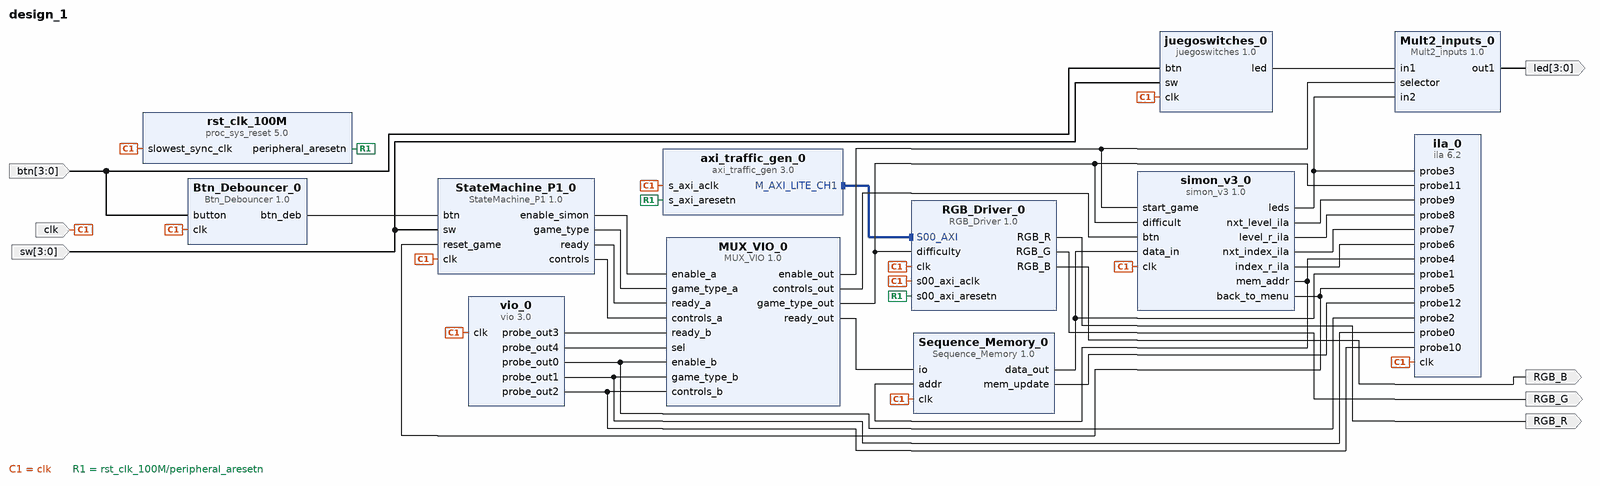
[diagram p0: block diagram of the top level]
# Vivado block design design_1, xc7z010clg400-1, Vivado 2020.1
create_bd_design design_1

create_bd_port -dir I -type clk clk
create_bd_port -dir I -from 3 -to 0 btn
create_bd_port -dir I -from 3 -to 0 sw
create_bd_port -dir O RGB_R
create_bd_port -dir O RGB_G
create_bd_port -dir O RGB_B
create_bd_port -dir O -from 3 -to 0 led

create_bd_cell -type ip -vlnv xilinx.com:user:Btn_Debouncer:1.0 Btn_Debouncer_0
create_bd_cell -type ip -vlnv xilinx.com:ip:vio:3.0 vio_0
set_property -dict [list \
  CONFIG.C_NUM_PROBE_IN 0 \
  CONFIG.C_NUM_PROBE_OUT 5 \
  CONFIG.C_PROBE_OUT0_WIDTH 1 \
  CONFIG.C_PROBE_OUT1_WIDTH 2 \
  CONFIG.C_PROBE_OUT2_WIDTH 4 \
] [get_bd_cells vio_0]
create_bd_cell -type ip -vlnv xilinx.com:ip:ila:6.2 ila_0
set_property -dict [list \
  CONFIG.C_ENABLE_ILA_AXI_MON false \
  CONFIG.C_MONITOR_TYPE Native \
  CONFIG.C_NUM_OF_PROBES 13 \
  CONFIG.C_PROBE0_WIDTH 2 \
  CONFIG.C_PROBE10_WIDTH 4 \
  CONFIG.C_PROBE1_WIDTH 4 \
  CONFIG.C_PROBE3_WIDTH 4 \
  CONFIG.C_PROBE4_WIDTH 5 \
  CONFIG.C_PROBE5_WIDTH 1 \
  CONFIG.C_PROBE6_WIDTH 5 \
  CONFIG.C_PROBE7_WIDTH 5 \
  CONFIG.C_PROBE8_WIDTH 6 \
  CONFIG.C_PROBE9_WIDTH 6 \
] [get_bd_cells ila_0]
create_bd_cell -type ip -vlnv xilinx.com:user:MUX_VIO:1.0 MUX_VIO_0
create_bd_cell -type ip -vlnv xilinx.com:ip:axi_traffic_gen:3.0 axi_traffic_gen_0
set_property -dict [list \
  CONFIG.C_ATG_MODE AXI4-Lite \
  CONFIG.C_ATG_SYSINIT_MODES System_Test \
  CONFIG.C_ATG_SYSTEM_CMD_MAX_RETRY 2147483647 \
  CONFIG.C_ATG_SYSTEM_INIT_ADDR_MIF ../../../../../../../COE_files/address.coe \
  CONFIG.C_ATG_SYSTEM_INIT_CTRL_MIF ../../../../../../../COE_files/control.coe \
  CONFIG.C_ATG_SYSTEM_INIT_DATA_MIF ../../../../../../../COE_files/data.coe \
  CONFIG.C_ATG_SYSTEM_INIT_MASK_MIF ../../../../../../../COE_files/mask.coe \
] [get_bd_cells axi_traffic_gen_0]
create_bd_cell -type ip -vlnv xilinx.com:user:StateMachine_P1:1.0 StateMachine_P1_0
create_bd_cell -type ip -vlnv xilinx.com:user:Mult2_inputs:1.0 Mult2_inputs_0
create_bd_cell -type ip -vlnv xilinx.com:ip:proc_sys_reset:5.0 rst_clk_100M
create_bd_cell -type ip -vlnv xilinx.com:user:simon_v3:1.0 simon_v3_0
create_bd_cell -type ip -vlnv xilinx.com:user:Sequence_Memory:1.0 Sequence_Memory_0
create_bd_cell -type ip -vlnv xilinx.com:user:RGB_Driver:1.0 RGB_Driver_0
create_bd_cell -type ip -vlnv xilinx.com:user:juegoswitches:1.0 juegoswitches_0

# ---- connections ----

connect_bd_intf_net [get_bd_intf_pins axi_traffic_gen_0/M_AXI_LITE_CH1] [get_bd_intf_pins RGB_Driver_0/S00_AXI]
connect_bd_net -net clk_0_1 [get_bd_ports clk] \
  [get_bd_pins Btn_Debouncer_0/clk] [get_bd_pins vio_0/clk] [get_bd_pins ila_0/clk] \
  [get_bd_pins axi_traffic_gen_0/s_axi_aclk] [get_bd_pins StateMachine_P1_0/clk] [get_bd_pins rst_clk_100M/slowest_sync_clk] \
  [get_bd_pins simon_v3_0/clk] [get_bd_pins Sequence_Memory_0/clk] [get_bd_pins RGB_Driver_0/clk] \
  [get_bd_pins RGB_Driver_0/s00_axi_aclk] [get_bd_pins juegoswitches_0/clk]
connect_bd_net [get_bd_pins Btn_Debouncer_0/btn_deb] [get_bd_pins StateMachine_P1_0/btn]
connect_bd_net [get_bd_ports btn] [get_bd_pins Btn_Debouncer_0/button] [get_bd_pins juegoswitches_0/btn]
connect_bd_net -net sw_0_1 [get_bd_ports sw] [get_bd_pins StateMachine_P1_0/sw] [get_bd_pins juegoswitches_0/sw]
connect_bd_net [get_bd_pins StateMachine_P1_0/enable_simon] [get_bd_pins MUX_VIO_0/enable_a]
connect_bd_net [get_bd_pins StateMachine_P1_0/game_type] [get_bd_pins MUX_VIO_0/game_type_a]
connect_bd_net [get_bd_pins vio_0/probe_out0] [get_bd_pins ila_0/probe2] [get_bd_pins MUX_VIO_0/enable_b]
connect_bd_net [get_bd_pins vio_0/probe_out1] [get_bd_pins ila_0/probe0] [get_bd_pins MUX_VIO_0/game_type_b]
connect_bd_net [get_bd_pins vio_0/probe_out2] [get_bd_pins ila_0/probe10] [get_bd_pins MUX_VIO_0/controls_b]
connect_bd_net [get_bd_pins MUX_VIO_0/enable_out] [get_bd_pins Mult2_inputs_0/selector] [get_bd_pins simon_v3_0/start_game]
connect_bd_net [get_bd_pins MUX_VIO_0/game_type_out] \
  [get_bd_pins ila_0/probe11] [get_bd_pins simon_v3_0/difficult] [get_bd_pins RGB_Driver_0/difficulty]
connect_bd_net [get_bd_pins Sequence_Memory_0/data_out] [get_bd_pins ila_0/probe1] [get_bd_pins simon_v3_0/data_in]
connect_bd_net [get_bd_pins simon_v3_0/nxt_level_ila] [get_bd_pins ila_0/probe9]
connect_bd_net [get_bd_pins simon_v3_0/level_r_ila] [get_bd_pins ila_0/probe8]
connect_bd_net [get_bd_pins simon_v3_0/nxt_index_ila] [get_bd_pins ila_0/probe7]
connect_bd_net [get_bd_pins simon_v3_0/index_r_ila] [get_bd_pins ila_0/probe6]
connect_bd_net [get_bd_pins simon_v3_0/back_to_menu] [get_bd_pins ila_0/probe5] [get_bd_pins StateMachine_P1_0/reset_game]
connect_bd_net [get_bd_pins simon_v3_0/mem_addr] [get_bd_pins ila_0/probe4] [get_bd_pins Sequence_Memory_0/addr]
connect_bd_net [get_bd_pins simon_v3_0/leds] [get_bd_pins ila_0/probe3] [get_bd_pins Mult2_inputs_0/in2]
connect_bd_net [get_bd_pins StateMachine_P1_0/ready] [get_bd_pins MUX_VIO_0/ready_a]
connect_bd_net [get_bd_pins vio_0/probe_out3] [get_bd_pins MUX_VIO_0/ready_b]
connect_bd_net [get_bd_pins vio_0/probe_out4] [get_bd_pins MUX_VIO_0/sel]
connect_bd_net [get_bd_pins MUX_VIO_0/controls_out] [get_bd_pins simon_v3_0/btn]
connect_bd_net -net StateMachine_P1_0_buttons [get_bd_pins StateMachine_P1_0/controls] [get_bd_pins MUX_VIO_0/controls_a]
connect_bd_net [get_bd_pins MUX_VIO_0/ready_out] [get_bd_pins Sequence_Memory_0/io]
connect_bd_net [get_bd_pins juegoswitches_0/led] [get_bd_pins Mult2_inputs_0/in1]
connect_bd_net [get_bd_pins Mult2_inputs_0/out1] [get_bd_ports led]
connect_bd_net [get_bd_pins rst_clk_100M/peripheral_aresetn] [get_bd_pins axi_traffic_gen_0/s_axi_aresetn] [get_bd_pins RGB_Driver_0/s00_axi_aresetn]
connect_bd_net [get_bd_pins Sequence_Memory_0/mem_update] [get_bd_pins ila_0/probe12]
connect_bd_net [get_bd_pins RGB_Driver_0/RGB_R] [get_bd_ports RGB_R]
connect_bd_net [get_bd_pins RGB_Driver_0/RGB_G] [get_bd_ports RGB_G]
connect_bd_net [get_bd_pins RGB_Driver_0/RGB_B] [get_bd_ports RGB_B]

# ---- address map ----
assign_bd_address -offset 0x44A00000 -range 64K -target_address_space [get_bd_addr_spaces axi_traffic_gen_0/Reg1] [get_bd_addr_segs RGB_Driver_0/S00_AXI/S00_AXI_reg]

validate_bd_design
save_bd_design
